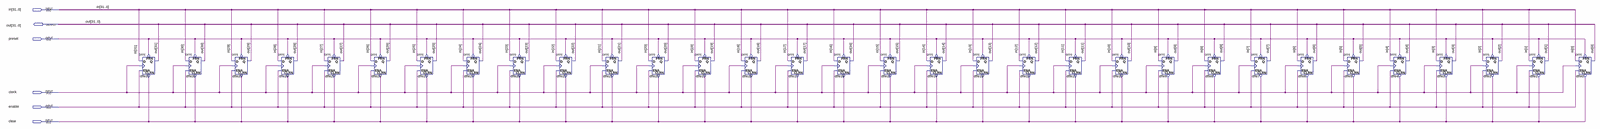
[diagram p0: schematic sheet, whole]
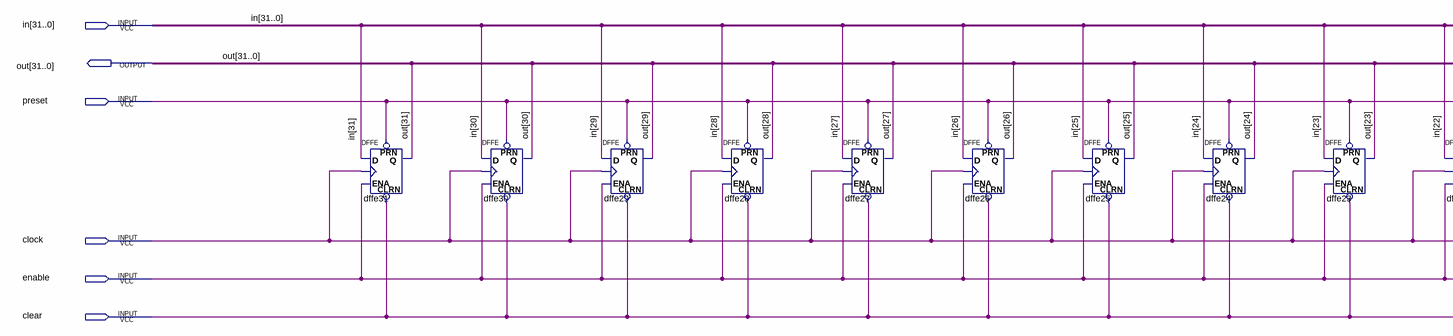
[diagram p1: schematic sheet, left part]
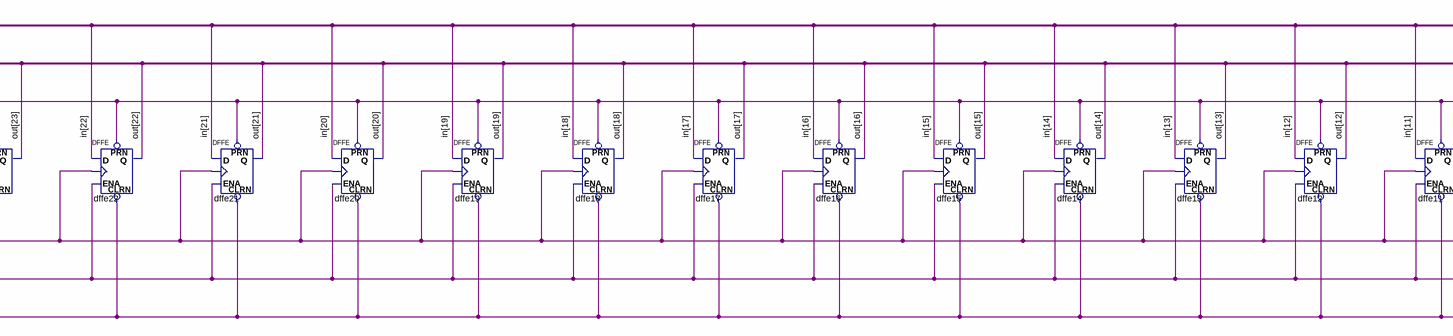
[diagram p2: schematic sheet, centre part]
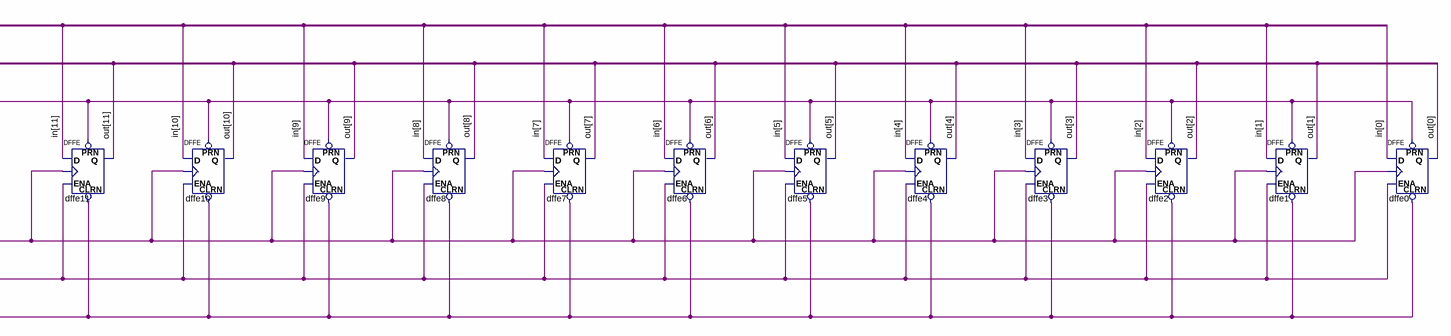
[diagram p3: schematic sheet, right part]
// Quartus schematic registrador.bdf as structural Verilog: 32 symbols, 6 pins
module registrador (
  input  [31:0] in,
  input  preset,
  input  clock,
  input  enable,
  input  clear,
  output [31:0] out
);

  DFFE dffe31 (.PRN(preset), .CLRN(clear), .D(in[31]), .CLK(clock), .ENA(enable), .Q(out[31]));
  DFFE dffe30 (.PRN(preset), .CLRN(clear), .D(in[30]), .CLK(clock), .ENA(enable), .Q(out[30]));
  DFFE dffe29 (.PRN(preset), .CLRN(clear), .D(in[29]), .CLK(clock), .ENA(enable), .Q(out[29]));
  DFFE dffe28 (.PRN(preset), .CLRN(clear), .D(in[28]), .CLK(clock), .ENA(enable), .Q(out[28]));
  DFFE dffe27 (.PRN(preset), .CLRN(clear), .D(in[27]), .CLK(clock), .ENA(enable), .Q(out[27]));
  DFFE dffe26 (.PRN(preset), .CLRN(clear), .D(in[26]), .CLK(clock), .ENA(enable), .Q(out[26]));
  DFFE dffe25 (.PRN(preset), .CLRN(clear), .D(in[25]), .CLK(clock), .ENA(enable), .Q(out[25]));
  DFFE dffe24 (.PRN(preset), .CLRN(clear), .D(in[24]), .CLK(clock), .ENA(enable), .Q(out[24]));
  DFFE dffe23 (.PRN(preset), .CLRN(clear), .D(in[23]), .CLK(clock), .ENA(enable), .Q(out[23]));
  DFFE dffe22 (.PRN(preset), .CLRN(clear), .D(in[22]), .CLK(clock), .ENA(enable), .Q(out[22]));
  DFFE dffe21 (.PRN(preset), .CLRN(clear), .D(in[21]), .CLK(clock), .ENA(enable), .Q(out[21]));
  DFFE dffe20 (.PRN(preset), .CLRN(clear), .D(in[20]), .CLK(clock), .ENA(enable), .Q(out[20]));
  DFFE dffe19 (.PRN(preset), .CLRN(clear), .D(in[19]), .CLK(clock), .ENA(enable), .Q(out[19]));
  DFFE dffe18 (.PRN(preset), .CLRN(clear), .D(in[18]), .CLK(clock), .ENA(enable), .Q(out[18]));
  DFFE dffe17 (.PRN(preset), .CLRN(clear), .D(in[17]), .CLK(clock), .ENA(enable), .Q(out[17]));
  DFFE dffe16 (.PRN(preset), .CLRN(clear), .D(in[16]), .CLK(clock), .ENA(enable), .Q(out[16]));
  DFFE dffe15 (.PRN(preset), .CLRN(clear), .D(in[15]), .CLK(clock), .ENA(enable), .Q(out[15]));
  DFFE dffe14 (.PRN(preset), .CLRN(clear), .D(in[14]), .CLK(clock), .ENA(enable), .Q(out[14]));
  DFFE dffe13 (.PRN(preset), .CLRN(clear), .D(in[13]), .CLK(clock), .ENA(enable), .Q(out[13]));
  DFFE dffe12 (.PRN(preset), .CLRN(clear), .D(in[12]), .CLK(clock), .ENA(enable), .Q(out[12]));
  DFFE dffe11 (.PRN(preset), .CLRN(clear), .D(in[11]), .CLK(clock), .ENA(enable), .Q(out[11]));
  DFFE dffe10 (.PRN(preset), .CLRN(clear), .D(in[10]), .CLK(clock), .ENA(enable), .Q(out[10]));
  DFFE dffe9 (.PRN(preset), .CLRN(clear), .D(in[9]), .CLK(clock), .ENA(enable), .Q(out[9]));
  DFFE dffe8 (.PRN(preset), .CLRN(clear), .D(in[8]), .CLK(clock), .ENA(enable), .Q(out[8]));
  DFFE dffe7 (.PRN(preset), .CLRN(clear), .D(in[7]), .CLK(clock), .ENA(enable), .Q(out[7]));
  DFFE dffe6 (.PRN(preset), .CLRN(clear), .D(in[6]), .CLK(clock), .ENA(enable), .Q(out[6]));
  DFFE dffe5 (.PRN(preset), .CLRN(clear), .D(in[5]), .CLK(clock), .ENA(enable), .Q(out[5]));
  DFFE dffe4 (.PRN(preset), .CLRN(clear), .D(in[4]), .CLK(clock), .ENA(enable), .Q(out[4]));
  DFFE dffe3 (.PRN(preset), .CLRN(clear), .D(in[3]), .CLK(clock), .ENA(enable), .Q(out[3]));
  DFFE dffe2 (.PRN(preset), .CLRN(clear), .D(in[2]), .CLK(clock), .ENA(enable), .Q(out[2]));
  DFFE dffe1 (.PRN(preset), .CLRN(clear), .D(in[1]), .CLK(clock), .ENA(enable), .Q(out[1]));
  DFFE dffe0 (.PRN(preset), .CLRN(clear), .D(in[0]), .CLK(clock), .ENA(enable), .Q(out[0]));
endmodule
